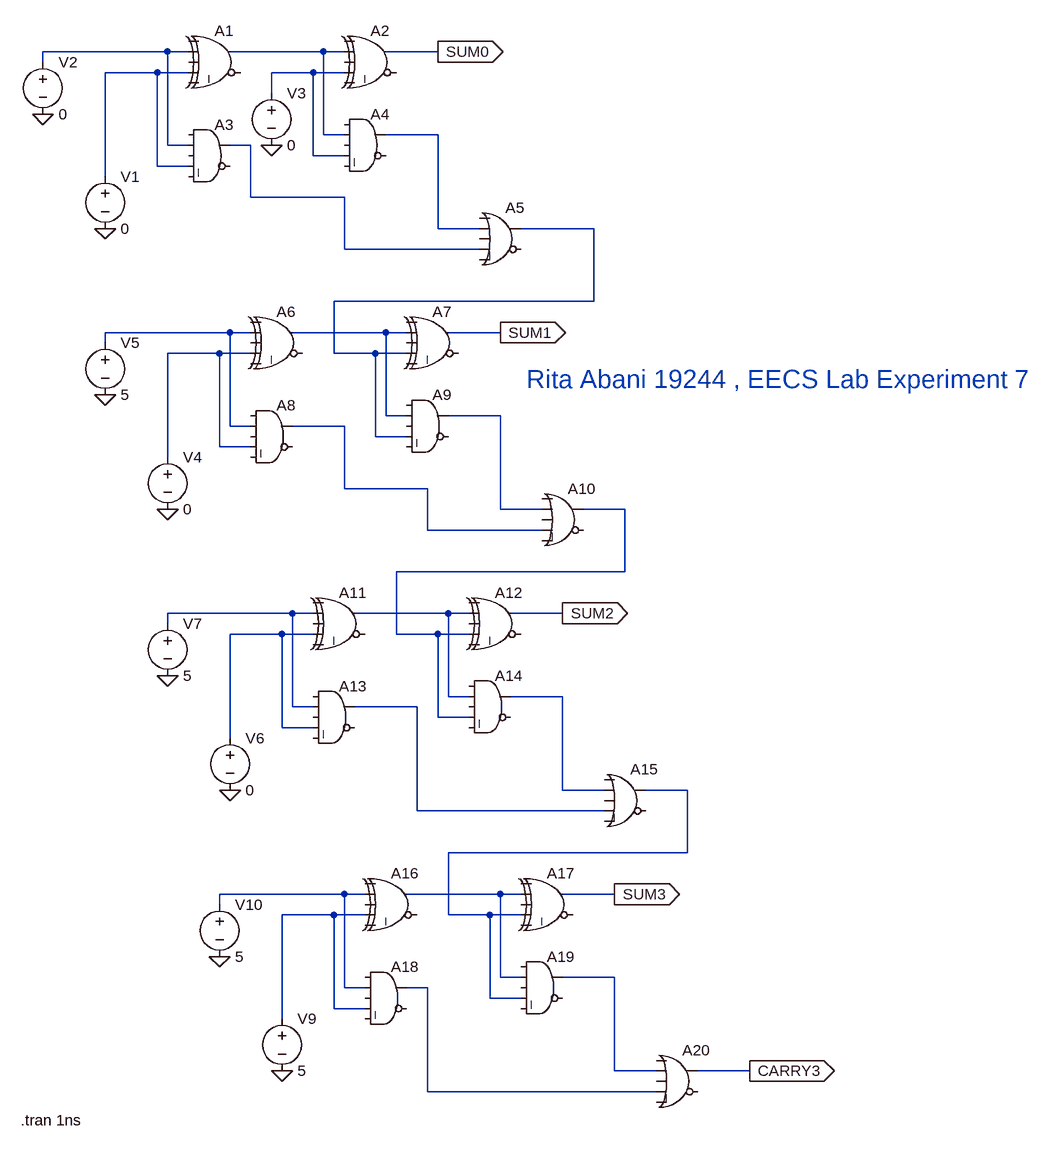
[diagram p0: schematic 4-bit full adder _ Rita.asc]
4-bit full adder _ Rita.asc, the LTspice schematic file:
Version 4
SHEET 1 3512 1756
WIRE 48 96 -144 96
WIRE 80 96 48 96
WIRE 288 96 144 96
WIRE 320 96 288 96
WIRE 464 96 384 96
WIRE -144 112 -144 96
WIRE 32 128 -48 128
WIRE 80 128 32 128
WIRE 272 128 208 128
WIRE 320 128 272 128
WIRE 208 160 208 128
WIRE 288 224 288 96
WIRE 320 224 288 224
WIRE 464 224 384 224
WIRE 48 240 48 96
WIRE 80 240 48 240
WIRE 176 240 144 240
WIRE 272 256 272 128
WIRE 320 256 272 256
WIRE 32 272 32 128
WIRE 80 272 32 272
WIRE -48 288 -48 128
WIRE 176 320 176 240
WIRE 320 320 176 320
WIRE 464 368 464 224
WIRE 528 368 464 368
WIRE 704 368 592 368
WIRE 320 400 320 320
WIRE 528 400 320 400
WIRE 704 480 704 368
WIRE 704 480 304 480
WIRE 144 528 -48 528
WIRE 176 528 144 528
WIRE 384 528 240 528
WIRE 416 528 384 528
WIRE 560 528 480 528
WIRE -48 544 -48 528
WIRE 128 560 48 560
WIRE 176 560 128 560
WIRE 304 560 304 480
WIRE 368 560 304 560
WIRE 416 560 368 560
WIRE 384 656 384 528
WIRE 416 656 384 656
WIRE 560 656 480 656
WIRE 144 672 144 528
WIRE 176 672 144 672
WIRE 320 672 240 672
WIRE 368 688 368 560
WIRE 416 688 368 688
WIRE 128 704 128 560
WIRE 176 704 128 704
WIRE 48 720 48 560
WIRE 320 768 320 672
WIRE 448 768 320 768
WIRE 560 800 560 656
WIRE 624 800 560 800
WIRE 752 800 688 800
WIRE 448 832 448 768
WIRE 624 832 448 832
WIRE 752 896 752 800
WIRE 752 896 400 896
WIRE 240 960 48 960
WIRE 272 960 240 960
WIRE 480 960 336 960
WIRE 512 960 480 960
WIRE 656 960 576 960
WIRE 48 976 48 960
WIRE 224 992 144 992
WIRE 272 992 224 992
WIRE 400 992 400 896
WIRE 464 992 400 992
WIRE 512 992 464 992
WIRE 480 1088 480 960
WIRE 512 1088 480 1088
WIRE 656 1088 576 1088
WIRE 240 1104 240 960
WIRE 272 1104 240 1104
WIRE 432 1104 336 1104
WIRE 464 1120 464 992
WIRE 512 1120 464 1120
WIRE 224 1136 224 992
WIRE 272 1136 224 1136
WIRE 144 1152 144 992
WIRE 656 1232 656 1088
WIRE 720 1232 656 1232
WIRE 848 1232 784 1232
WIRE 432 1264 432 1104
WIRE 720 1264 432 1264
WIRE 848 1328 848 1232
WIRE 848 1328 480 1328
WIRE 320 1392 128 1392
WIRE 352 1392 320 1392
WIRE 560 1392 416 1392
WIRE 592 1392 560 1392
WIRE 736 1392 656 1392
WIRE 128 1408 128 1392
WIRE 304 1424 224 1424
WIRE 352 1424 304 1424
WIRE 480 1424 480 1328
WIRE 544 1424 480 1424
WIRE 592 1424 544 1424
WIRE 560 1520 560 1392
WIRE 592 1520 560 1520
WIRE 736 1520 656 1520
WIRE 320 1536 320 1392
WIRE 352 1536 320 1536
WIRE 448 1536 416 1536
WIRE 544 1552 544 1424
WIRE 592 1552 544 1552
WIRE 304 1568 304 1424
WIRE 352 1568 304 1568
WIRE 224 1584 224 1424
WIRE 736 1664 736 1520
WIRE 800 1664 736 1664
WIRE 944 1664 864 1664
WIRE 448 1696 448 1536
WIRE 800 1696 448 1696
FLAG 208 240 0
FLAG -48 368 0
FLAG -144 192 0
FLAG 464 96 SUM0
IOPIN 464 96 Out
FLAG 48 800 0
FLAG -48 624 0
FLAG 560 528 SUM1
IOPIN 560 528 Out
FLAG 144 1232 0
FLAG 48 1056 0
FLAG 656 960 SUM2
IOPIN 656 960 Out
FLAG 224 1664 0
FLAG 128 1488 0
FLAG 736 1392 SUM3
IOPIN 736 1392 Out
FLAG 944 1664 CARRY3
IOPIN 944 1664 Out
SYMBOL Digital\\xor 128 48 R0
SYMATTR InstName A1
SYMBOL Digital\\xor 368 48 R0
SYMATTR InstName A2
SYMBOL Digital\\and 112 192 R0
SYMATTR InstName A3
SYMBOL Digital\\and 352 176 R0
SYMATTR InstName A4
SYMBOL Digital\\or 560 320 R0
SYMATTR InstName A5
SYMBOL voltage -48 272 R0
WINDOW 123 0 0 Left 0
WINDOW 39 0 0 Left 0
SYMATTR InstName V1
SYMATTR Value 0
SYMBOL voltage -144 96 R0
WINDOW 123 0 0 Left 0
WINDOW 39 0 0 Left 0
SYMATTR InstName V2
SYMATTR Value 0
SYMBOL voltage 208 144 R0
WINDOW 123 0 0 Left 0
WINDOW 39 0 0 Left 0
SYMATTR InstName V3
SYMATTR Value 0
SYMBOL Digital\\xor 224 480 R0
SYMATTR InstName A6
SYMBOL Digital\\xor 464 480 R0
SYMATTR InstName A7
SYMBOL Digital\\and 208 624 R0
SYMATTR InstName A8
SYMBOL Digital\\and 448 608 R0
SYMATTR InstName A9
SYMBOL Digital\\or 656 752 R0
SYMATTR InstName A10
SYMBOL voltage 48 704 R0
WINDOW 123 0 0 Left 0
WINDOW 39 0 0 Left 0
SYMATTR InstName V4
SYMATTR Value 0
SYMBOL voltage -48 528 R0
WINDOW 123 0 0 Left 0
WINDOW 39 0 0 Left 0
SYMATTR InstName V5
SYMATTR Value 5
SYMBOL Digital\\xor 320 912 R0
SYMATTR InstName A11
SYMBOL Digital\\xor 560 912 R0
SYMATTR InstName A12
SYMBOL Digital\\and 304 1056 R0
SYMATTR InstName A13
SYMBOL Digital\\and 544 1040 R0
SYMATTR InstName A14
SYMBOL Digital\\or 752 1184 R0
SYMATTR InstName A15
SYMBOL voltage 144 1136 R0
WINDOW 123 0 0 Left 0
WINDOW 39 0 0 Left 0
SYMATTR InstName V6
SYMATTR Value 0
SYMBOL voltage 48 960 R0
WINDOW 123 0 0 Left 0
WINDOW 39 0 0 Left 0
SYMATTR InstName V7
SYMATTR Value 5
SYMBOL Digital\\xor 400 1344 R0
SYMATTR InstName A16
SYMBOL Digital\\xor 640 1344 R0
SYMATTR InstName A17
SYMBOL Digital\\and 384 1488 R0
SYMATTR InstName A18
SYMBOL Digital\\and 624 1472 R0
SYMATTR InstName A19
SYMBOL Digital\\or 832 1616 R0
SYMATTR InstName A20
SYMBOL voltage 224 1568 R0
WINDOW 123 0 0 Left 0
WINDOW 39 0 0 Left 0
SYMATTR InstName V9
SYMATTR Value 5
SYMBOL voltage 128 1392 R0
WINDOW 123 0 0 Left 0
WINDOW 39 0 0 Left 0
SYMATTR InstName V10
SYMATTR Value 5
TEXT 600 600 Left 4 ;Rita Abani 19244 , EECS Lab Experiment 7
TEXT -178 1740 Left 2 !.tran 1ns

The netlist it stands for:
* 4-bit full adder _ Rita.asc
A1 0 N001 0 N003 0 0 N002 0 XOR
A2 0 N002 0 N004 0 0 SUM0 0 XOR
A3 0 N001 0 N003 0 0 N006 0 AND
A4 0 N002 0 N004 0 0 N005 0 AND
A5 0 N005 0 N006 0 0 N007 0 OR
V1 N003 0 0
V2 N001 0 0
V3 N004 0 0
A6 0 N008 0 N010 0 0 N009 0 XOR
A7 0 N009 0 N007 0 0 SUM1 0 XOR
A8 0 N008 0 N010 0 0 N012 0 AND
A9 0 N009 0 N007 0 0 N011 0 AND
A10 0 N011 0 N012 0 0 N013 0 OR
V4 N010 0 0
V5 N008 0 5
A11 0 N014 0 N016 0 0 N015 0 XOR
A12 0 N015 0 N013 0 0 SUM2 0 XOR
A13 0 N014 0 N016 0 0 N018 0 AND
A14 0 N015 0 N013 0 0 N017 0 AND
A15 0 N017 0 N018 0 0 N019 0 OR
V6 N016 0 0
V7 N014 0 5
A16 0 N020 0 N022 0 0 N021 0 XOR
A17 0 N021 0 N019 0 0 SUM3 0 XOR
A18 0 N020 0 N022 0 0 N024 0 AND
A19 0 N021 0 N019 0 0 N023 0 AND
A20 0 N023 0 N024 0 0 CARRY3 0 OR
V9 N022 0 5
V10 N020 0 5
* Rita Abani 19244 , EECS Lab Experiment 7
.tran 1ns
.backanno
.end